# Altium project EIS_Flow.PrjPcb
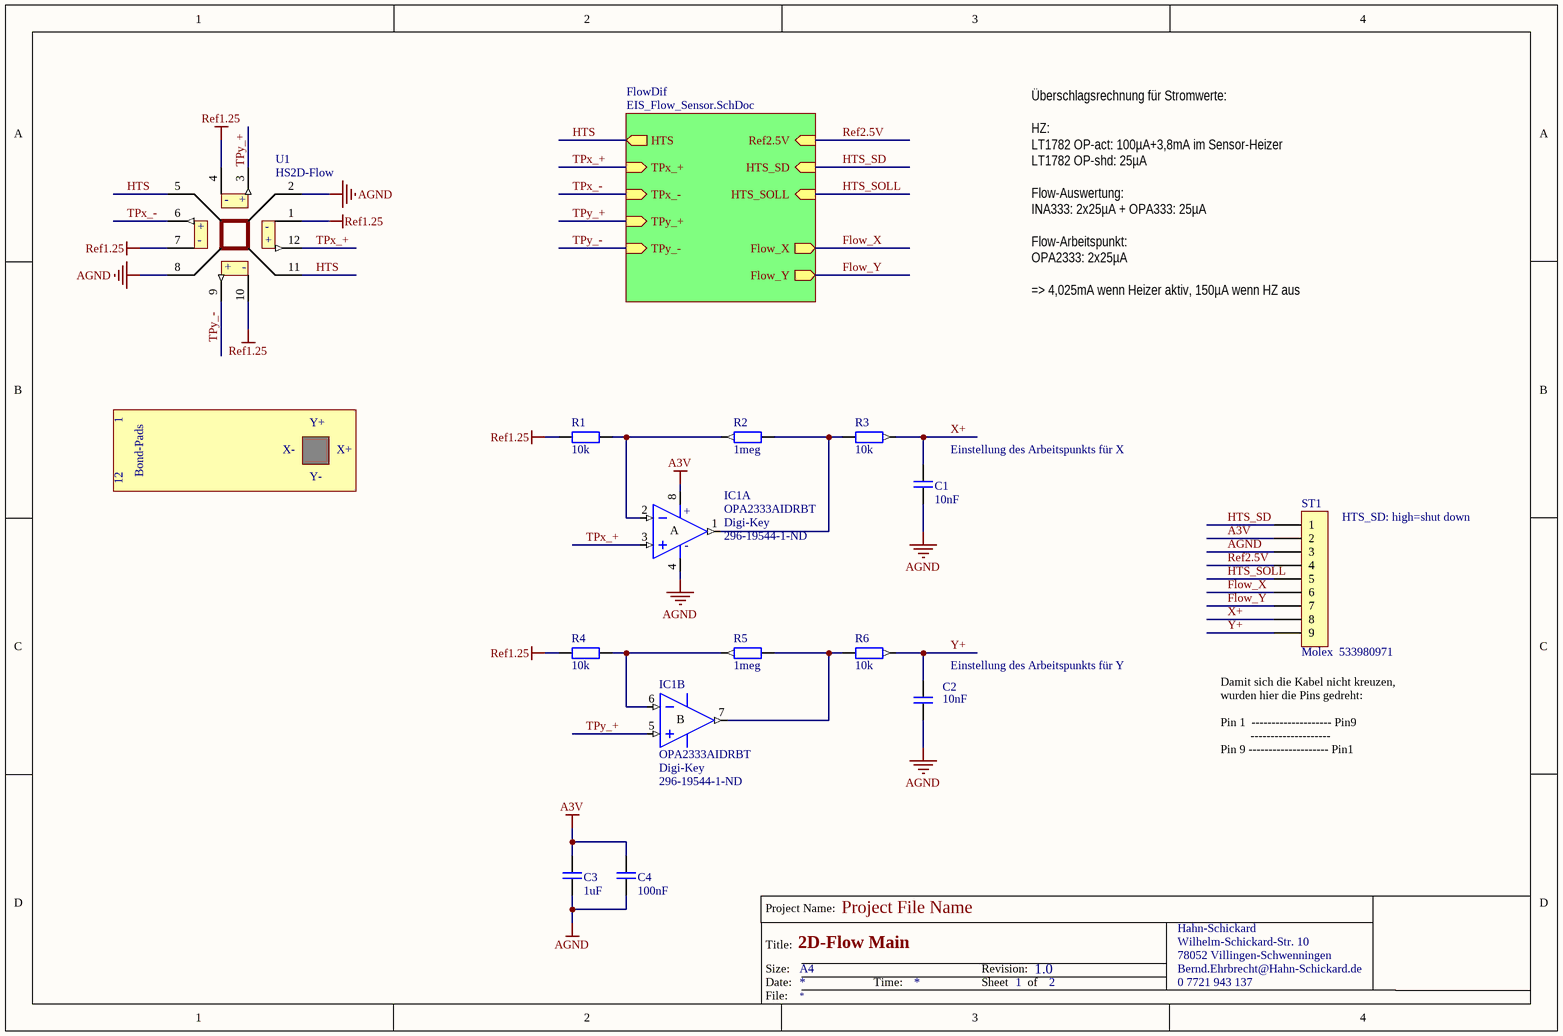
[diagram p0: EIS_Flow_Main.SchDoc]
2 sheets, 43 parts. Net scope: hierarchical (ports join the sheet entries above them; power ports are global).
Board file: EIS_Flow.PcbDoc
Sheets:
  EIS_Flow_Main.SchDoc
    FlowDif = EIS_Flow_Sensor.SchDoc

## Sheet EIS_Flow_Main.SchDoc: 2D-Flow Main
size A4; Organization: Hahn-Schickard; Address1: Wilhelm-Schickard-Str. 10; Address2: 78052 Villingen-Schwenningen; Address3: Bernd.Ehrbrecht@Hahn-Schickard.de; DocumentNumber: 1; Revision: 1.0; SheetNumber: 1; SheetTotal: 2; PhoneNumber: 0 7721 943 137; E-Mail: Xxxx.Xxxx@Hahn-Schickard.de; PageSetup: Record=PageOptions|CenterHorizontal=True|CenterVertical=True|PrintScale=0.97|XCorrection=1.00|YCorrection=1.00|PrintKind=1|BorderSize=5000000|LeftOffset=0|BottomOffset=0|Orientation=2|PaperLength=1000|PaperWidth=1000|Scale=100|PaperSource=15|PrintQuality=600|MediaType=1|DitherType=10|PrintScaleMode=1|PaperKind=A4 (210 x 297 mm)|PaperIndex=9; ProjectName: Project File Name

### Parts
C1  10nF  [CAPC1608N]
C2  10nF  [CAPC1608N]
C3  1uF  [CAPC2012N]
C4  100nF  [CAPC1608N]
IC1  OPA2333AIDRBT  Supplier 1: Digi-Key  Supplier Part Number 1: 296-19544-1-ND  [TI DRB (S-PVON-N8)]  (parts A,B of 2)
R1  10k  [RESC1608N]
R2  1meg  [RESC1608N]
R3  10k  [RESC1608N]
R4  10k  [RESC1608N]
R5  1meg  [RESC1608N]
R6  10k  [RESC1608N]
ST1  Molex  533980971  [Picoblade 9*1,25V]
U1  HS2D-Flow  [Bond_Flow_12p]

### Sub-sheets
FlowDif = EIS_Flow_Sensor.SchDoc: HTS_SD (in), HTS_SOLL (in), Ref2.5V (in), HTS (out), Flow_X (out), TPx_+ (in), TPx_- (in), Flow_Y (out), TPy_+ (in), TPy_- (in)

### Nets
A3V: C3.1 C4.1 IC1.8(V+) ST1.2
AGND: C1.1 C2.2 C3.2 C4.2 IC1.4(V-) ST1.3 U1.2(HZ_nw) U1.8(HZ_so)
Ref1.25: R1.1 R4.1 U1.1(TPn-) U1.4(TPw-) U1.7(TPs-) U1.10(TPo-)
Flow_X: ST1.6 ; sheet FlowDif/Flow_X
Flow_Y: ST1.7 ; sheet FlowDif/Flow_Y
HTS: U1.5(HZ_sw) U1.11(HZ_no) ; sheet FlowDif/HTS
HTS_SD: ST1.1 ; sheet FlowDif/HTS_SD
HTS_SOLL: ST1.5 ; sheet FlowDif/HTS_SOLL
Ref2.5V: ST1.4 ; sheet FlowDif/Ref2.5V
TPx_+: IC1.3(IN1+) U1.12(TPn+) ; sheet FlowDif/TPx_+
TPx_-: U1.6(TPs+) ; sheet FlowDif/TPx_-
TPy_+: IC1.5(IN1+) U1.3(TPw+) ; sheet FlowDif/TPy_+
TPy_-: U1.9(TPo+) ; sheet FlowDif/TPy_-
X+: C1.2 R3.2 ST1.8
Y+: C2.1 R6.2 ST1.9
NetIC1_1: IC1.1(OUT1) R2.2 R3.1
NetIC1_2: IC1.2(IN1-) R1.2 R2.1
NetIC1_6: IC1.6(IN1-) R4.2 R5.1
NetIC1_7: IC1.7(OUT1) R5.2 R6.1

### Notes on the sheet
- Überschlagsrechnung für Stromwerte:
  HZ:
  LT1782 OP-act: 100µA+3,8mA im Sensor-Heizer
  LT1782 OP-shd: 25µA
  Flow-Auswertung:
  INA333: 2x25µA + OPA333: 25µA
  Flow-Arbeitspunkt:
  OPA2333: 2x25µA
  => 4,025mA wenn Heizer aktiv, 150µA wenn HZ aus
- 1
- Y+
- 12
- Bond-Pads
- X-
- Y-
- X+
- (near C1) Einstellung des Arbeitspunkts für X
- (near ST1) HTS_SD: high=shut down
- (near C2) Einstellung des Arbeitspunkts für Y
- (near ST1) Damit sich die Kabel nicht kreuzen, wurden hier die Pins gedreht:
  Pin 1  -------------------- Pin9
  --------------------
  Pin 9 -------------------- Pin1
- Project Name:
- Size:
- Date:
- Title:
- A4
- Time:
- Revision:
- Sheet
- of
- File:
- (in symbol HS2D-Flow) -; +
- (in symbol OPA2333AIDRBT, part A) +; A; -
- (in symbol OPA2333AIDRBT, part B) B

### Library data of the parts
C1-C4 = Kondensator SMD Keramik
IC1 = OPA2333AIDRBT: Dual micro Power OP; 01_Hersteller: Texas Instruments; 05_Datasheet_Link_Lokal: O:\Altium Designer\Datasheets\Texas Instruments\OPA333; 09_Ersteller: HSG Jürgen Merz; 07_Lieferant: Farnell; 08_Lieferanten_Nummer: 1408162; 02_Herstellerbezeichnung: ka; 03_Hersteller_Link: http://www.ti.com; 04_Datasheet_Link: Datasheet; 06 Footprint_Link_Lokal: O:\Altium Designer\Datasheets\Texas Instruments\OPA333; 10_Erstell_Datum: 12.10.2010
R1-R6 = Widerstand SMD
ST1 = MOLEX_Picoblade_9V
U1 = HS2D-Flow: 2d Strömungssensor Hahn-Schickard

## Sheet EIS_Flow_Sensor.SchDoc: 2D-Flow Heizer & Sensor-Verstärker
size A4; FaxNumber: +49 7721 943 140; Organization: Hahn-Schickard; Address1: Wilhelm-Schickard-Str. 10; Address2: 78052 Villingen-Schwenningen; Address3: Bernd.Ehrbrecht@Hahn-Schickard.de; DocumentNumber: 1; Revision: 1.0; SheetNumber: 2; SheetTotal: 2; PhoneNumber: 0 7721 943 137; E-Mail: Xxxx.Xxxx@Hahn-Schickard.de; ProjectName: Project File Name
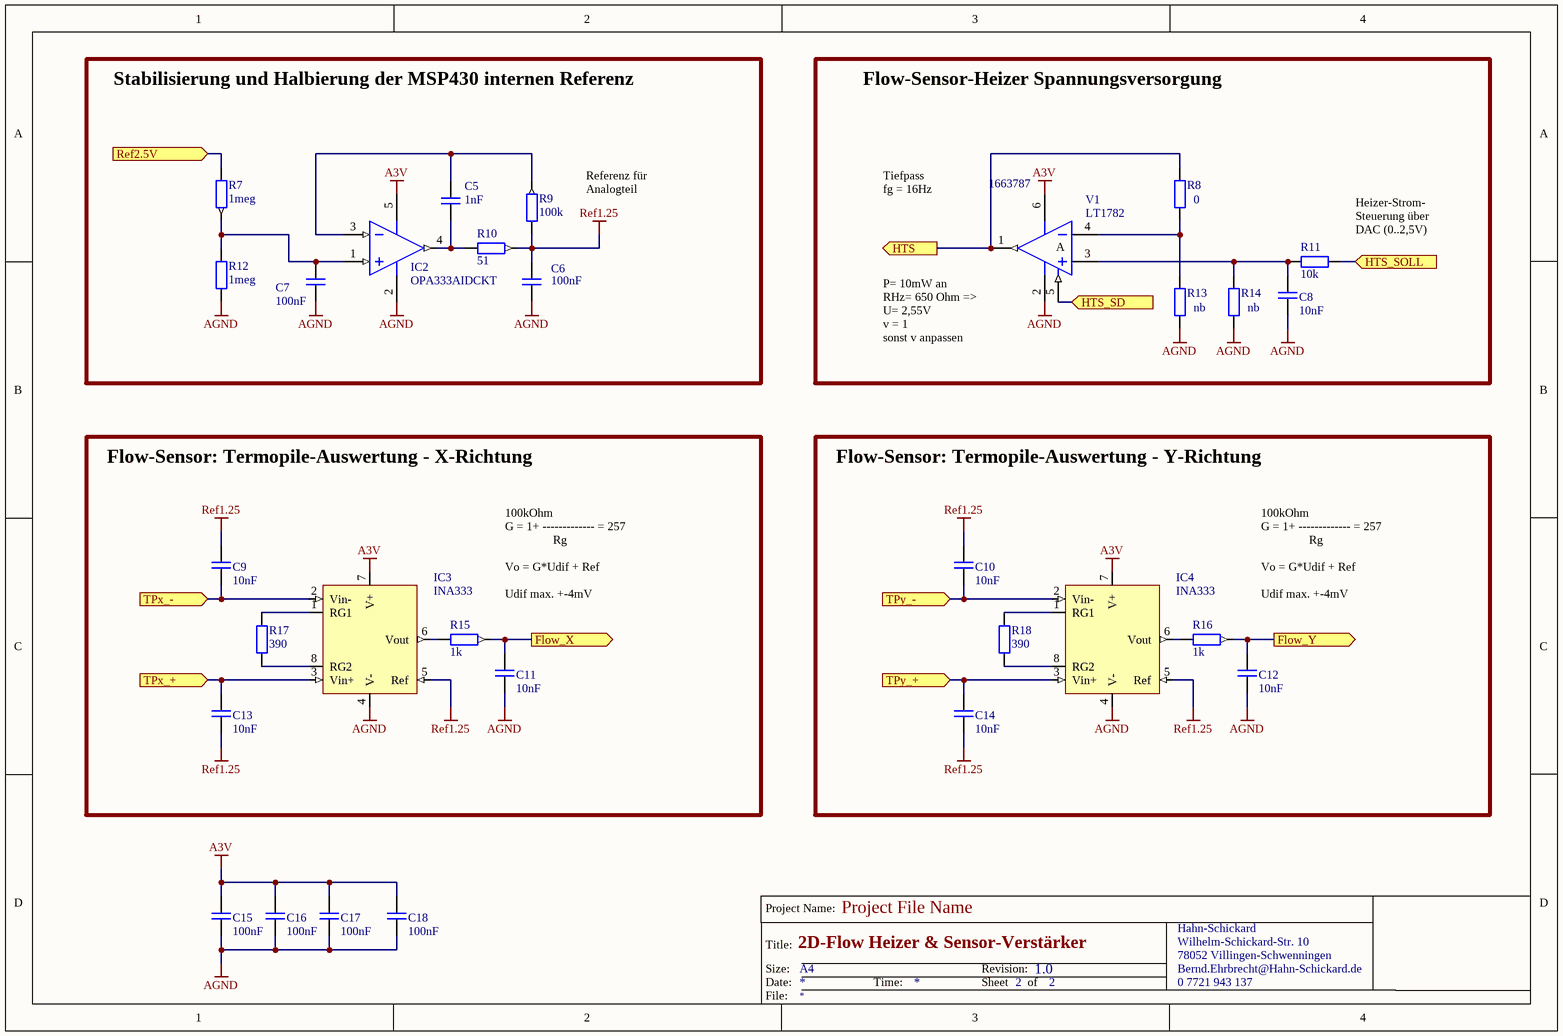
[diagram p1: EIS_Flow_Sensor.SchDoc]

### Parts
C5  1nF  [CAPC1608N]
C6  100nF  [CAPC1608N]
C7  100nF  [CAPC1608N]
C8  10nF  [CAPC1608N]
C9  10nF  [CAPC1608N]
C10  10nF  [CAPC1608N]
C11  10nF  [CAPC1608N]
C12  10nF  [CAPC1608N]
C13  10nF  [CAPC1608N]
C14  10nF  [CAPC1608N]
C15  100nF  [CAPC1608N]
C16  100nF  [CAPC1608N]
C17  100nF  [CAPC1608N]
C18  100nF  [CAPC1608N]
IC2  OPA333AIDCKT  [TI-DCK5_V]
IC3  INA333  [TI-DRG8-2400X1450TP_V]
IC4  INA333  [TI-DRG8-2400X1450TP_V]
R7  1meg  [RESC1608N]
R8  0  [RESC1608N]
R9  100k  [RESC1608N]
R10  51  [RESC1608N]
R11  10k  [RESC1608N]
R12  1meg  [RESC1608N]
R13  nb  [RESC1608N]
R14  nb  [RESC1608N]
R15  1k  [RESC1608N]
R16  1k  [RESC1608N]
R17  390  [RESC1608N]
R18  390  [RESC1608N]
V1  LT1782  Supplier Part Number 1: 1663787  [SOT23-6]

### Ports
Flow_X (out), Flow_Y (out), HTS (out), HTS_SD (in), HTS_SOLL (in), Ref2.5V (in), TPx_+ (in), TPx_- (in), TPy_+ (in), TPy_- (in)

### Nets
A3V: C15.1 C16.1 C17.1 C18.2 IC2.5(V+) IC3.7(V+) IC4.7(V+) V1.6(V+)
AGND: C6.2 C7.2 C8.1 C11.1 C12.1 C15.2 C16.2 C17.2 C18.1 IC2.2(V-) IC3.4(V-) IC4.4(V-) R12.2 R13.1 R14.1 V1.2(V-)
Ref1.25: C6.1 C9.1 C10.1 C13.2 C14.2 IC3.5(Ref) IC4.5(Ref) R9.2 R10.1
Flow_X: C11.2 R15.1 ; port Flow_X
Flow_Y: C12.2 R16.1 ; port Flow_Y
HTS: R8.2 V1.1(OUT) ; port HTS
HTS_SD: V1.5(Shdn) ; port HTS_SD
HTS_SOLL: R11.1 ; port HTS_SOLL
Ref2.5V: R7.1 ; port Ref2.5V
TPx_+: C13.1 IC3.3(Vin+) ; port TPx_+
TPx_-: C9.2 IC3.2(Vin-) ; port TPx_-
TPy_+: C14.1 IC4.3(Vin+) ; port TPy_+
TPy_-: C10.2 IC4.2(Vin-) ; port TPy_-
NetC5_1: C5.1 IC2.3(IN-) R9.1
NetC5_2: C5.2 IC2.4(OUT) R10.2
NetC7_1: C7.1 IC2.1(IN+) R7.2 R12.1
NetC8_2: C8.2 R11.2 R14.2 V1.3(IN+)
NetIC3_1: IC3.1(RG1) R17.2
NetIC3_6: IC3.6(Vout) R15.2
NetIC3_8: IC3.8(RG2) R17.1
NetIC4_1: IC4.1(RG1) R18.2
NetIC4_6: IC4.6(Vout) R16.2
NetIC4_8: IC4.8(RG2) R18.1
NetR8_1: R8.1 R13.2 V1.4(IN-)

### Notes on the sheet
- Stabilisierung und Halbierung der MSP430 internen Referenz
- Flow-Sensor-Heizer Spannungsversorgung
- Referenz für
  Analogteil
- Tiefpass
  fg = 16Hz
- (near R11) Heizer-Strom-
  Steuerung über DAC (0..2,5V)
- (near V1) P= 10mW an
  RHz= 650 Ohm =>
  U= 2,55V
  v = 1
  sonst v anpassen
- Flow-Sensor: Termopile-Auswertung - X-Richtung
- Flow-Sensor: Termopile-Auswertung - Y-Richtung
- 100kOhm
  G = 1+ ------------- = 257
  Rg
  Vo = G*Udif + Ref
  Udif max. +-4mV
- Project Name:
- Size:
- Date:
- Title:
- A4
- Time:
- Revision:
- Sheet
- of
- File:
- (in symbol LT1782_SD) A

### Library data of the parts
C5-C18 = Kondensator SMD Keramik
IC2 = OPA333AIDCKT: 17 uA, MicroPower, Precision, Zero Drift CMOS Operational Amplifier, 1.8 to 5.5 V, -40 to 125 degC, 5-pin SOT23 (DCK5), Green (RoHS & no Sb/Br); Manufacturer: Texas Instruments; CMRR(Min)(dB): 106; IIB(Max)(pA): 200; Iq per channel(Max)(mA): 0.025; Number of Channels: 1; Offset Drift(Typ)(uV/C): 0.02; Slew Rate(Typ)(V/us): 0.16; Sub Family: Low Offset Voltage Amplifier (<=500uV), Low Power Amp (<=500uA), Low Supply Voltage Amplifier (<=2.7V), Precision Amplifier, Zero Drift Precision Amplifier; Total Supply Voltage(Max)(+5V is 5, +/-5V is 10): 5.5; Total Supply Voltage(Min)(+5V is 5, +/-5V is 10): 1.8; Vio (25C)(Max)(mV): 0.01; DatasheetVersion: SBOS351C; PackageVersion: 4093553-3/G, 01/2007; PackageReference: DCK5; PackageDescription: 5-Pin Plastic Small Outline, Body 2 x 1.25 mm, Pitch 0.65 mm; Supplier 1: Digi-Key; Supplier Part Number 1: 296-26270-2-ND; Supplier 2: Digi-Key; Supplier Part Number 2: 296-26270-1-ND; Supplier 3: Digi-Key; Supplier Part Number 3: 296-26270-6-ND; Supplier 4: Farnell; Supplier Part Number 4: 1273122; Supplier 5: Newark; Supplier Part Number 5: 80K2661; Supplier 6: Mouser; Supplier Part Number 6: 595-OPA333AIDCKT; Eco-Plan: Green (RoHS & no Sb/Br); Mounting Technology: Surface Mount; Code_JEDEC: MO-203; PartNumber: OPA333AIDCKT; ComponentLink1Description: Manufacturer URL; ComponentLink1URL: http://www.ti.com/; ComponentLink2Description: Datasheet; ComponentLink2URL: http://www.ti.com/general/docs/lit/getliterature.tsp?genericPartNumber=OPA333&fileType=pdf; ComponentLink3Description: Package Specification; ComponentLink3URL: http://www.ti.com/litv/pdf/mpds025f
IC3 IC4 = INA333: Instrumentation Amplifier; Package Document: O:\Altium Designer\Datasheets\Texas Instruments\INA333; Suplier: Seller; Suplier Ordering Number: Ordering Number; ComponentLink1Description: Texas Instruments; ComponentLink1URL: http://www.ti.com; ComponentLink2Description: Datasheet; ComponentLink2URL: http://www.ti.com; DatasheetDokument: O:\Altium Designer\Datasheets\Texas Instruments\INA333; Published: 12.10.2010; Publisher: HSG Jürgen Merz
R7-R18 = Widerstand SMD
V1 = LT1782_SD: Supplier 1: Farnell

## Nets that join several sheets
A3V: EIS_Flow_Main (C3.1 C4.1 IC1.8 ST1.2), EIS_Flow_Sensor (8 pins)
AGND: EIS_Flow_Main (8 pins), EIS_Flow_Sensor (16 pins)
Ref1.25: EIS_Flow_Main (6 pins), EIS_Flow_Sensor (9 pins)
Flow_X: EIS_Flow_Main (ST1.6), EIS_Flow_Sensor (C11.2 R15.1)
Flow_Y: EIS_Flow_Main (ST1.7), EIS_Flow_Sensor (C12.2 R16.1)
HTS: EIS_Flow_Main (U1.5 U1.11), EIS_Flow_Sensor (R8.2 V1.1)
HTS_SD: EIS_Flow_Main (ST1.1), EIS_Flow_Sensor (V1.5)
HTS_SOLL: EIS_Flow_Main (ST1.5), EIS_Flow_Sensor (R11.1)
Ref2.5V: EIS_Flow_Main (ST1.4), EIS_Flow_Sensor (R7.1)
TPx_+: EIS_Flow_Main (IC1.3 U1.12), EIS_Flow_Sensor (C13.1 IC3.3)
TPx_-: EIS_Flow_Main (U1.6), EIS_Flow_Sensor (C9.2 IC3.2)
TPy_+: EIS_Flow_Main (IC1.5 U1.3), EIS_Flow_Sensor (C14.1 IC4.3)
TPy_-: EIS_Flow_Main (U1.9), EIS_Flow_Sensor (C10.2 IC4.2)